# Altium schematic sheet MCU.SchDoc
size A3; SheetNumber: 2; SheetTotal: 3
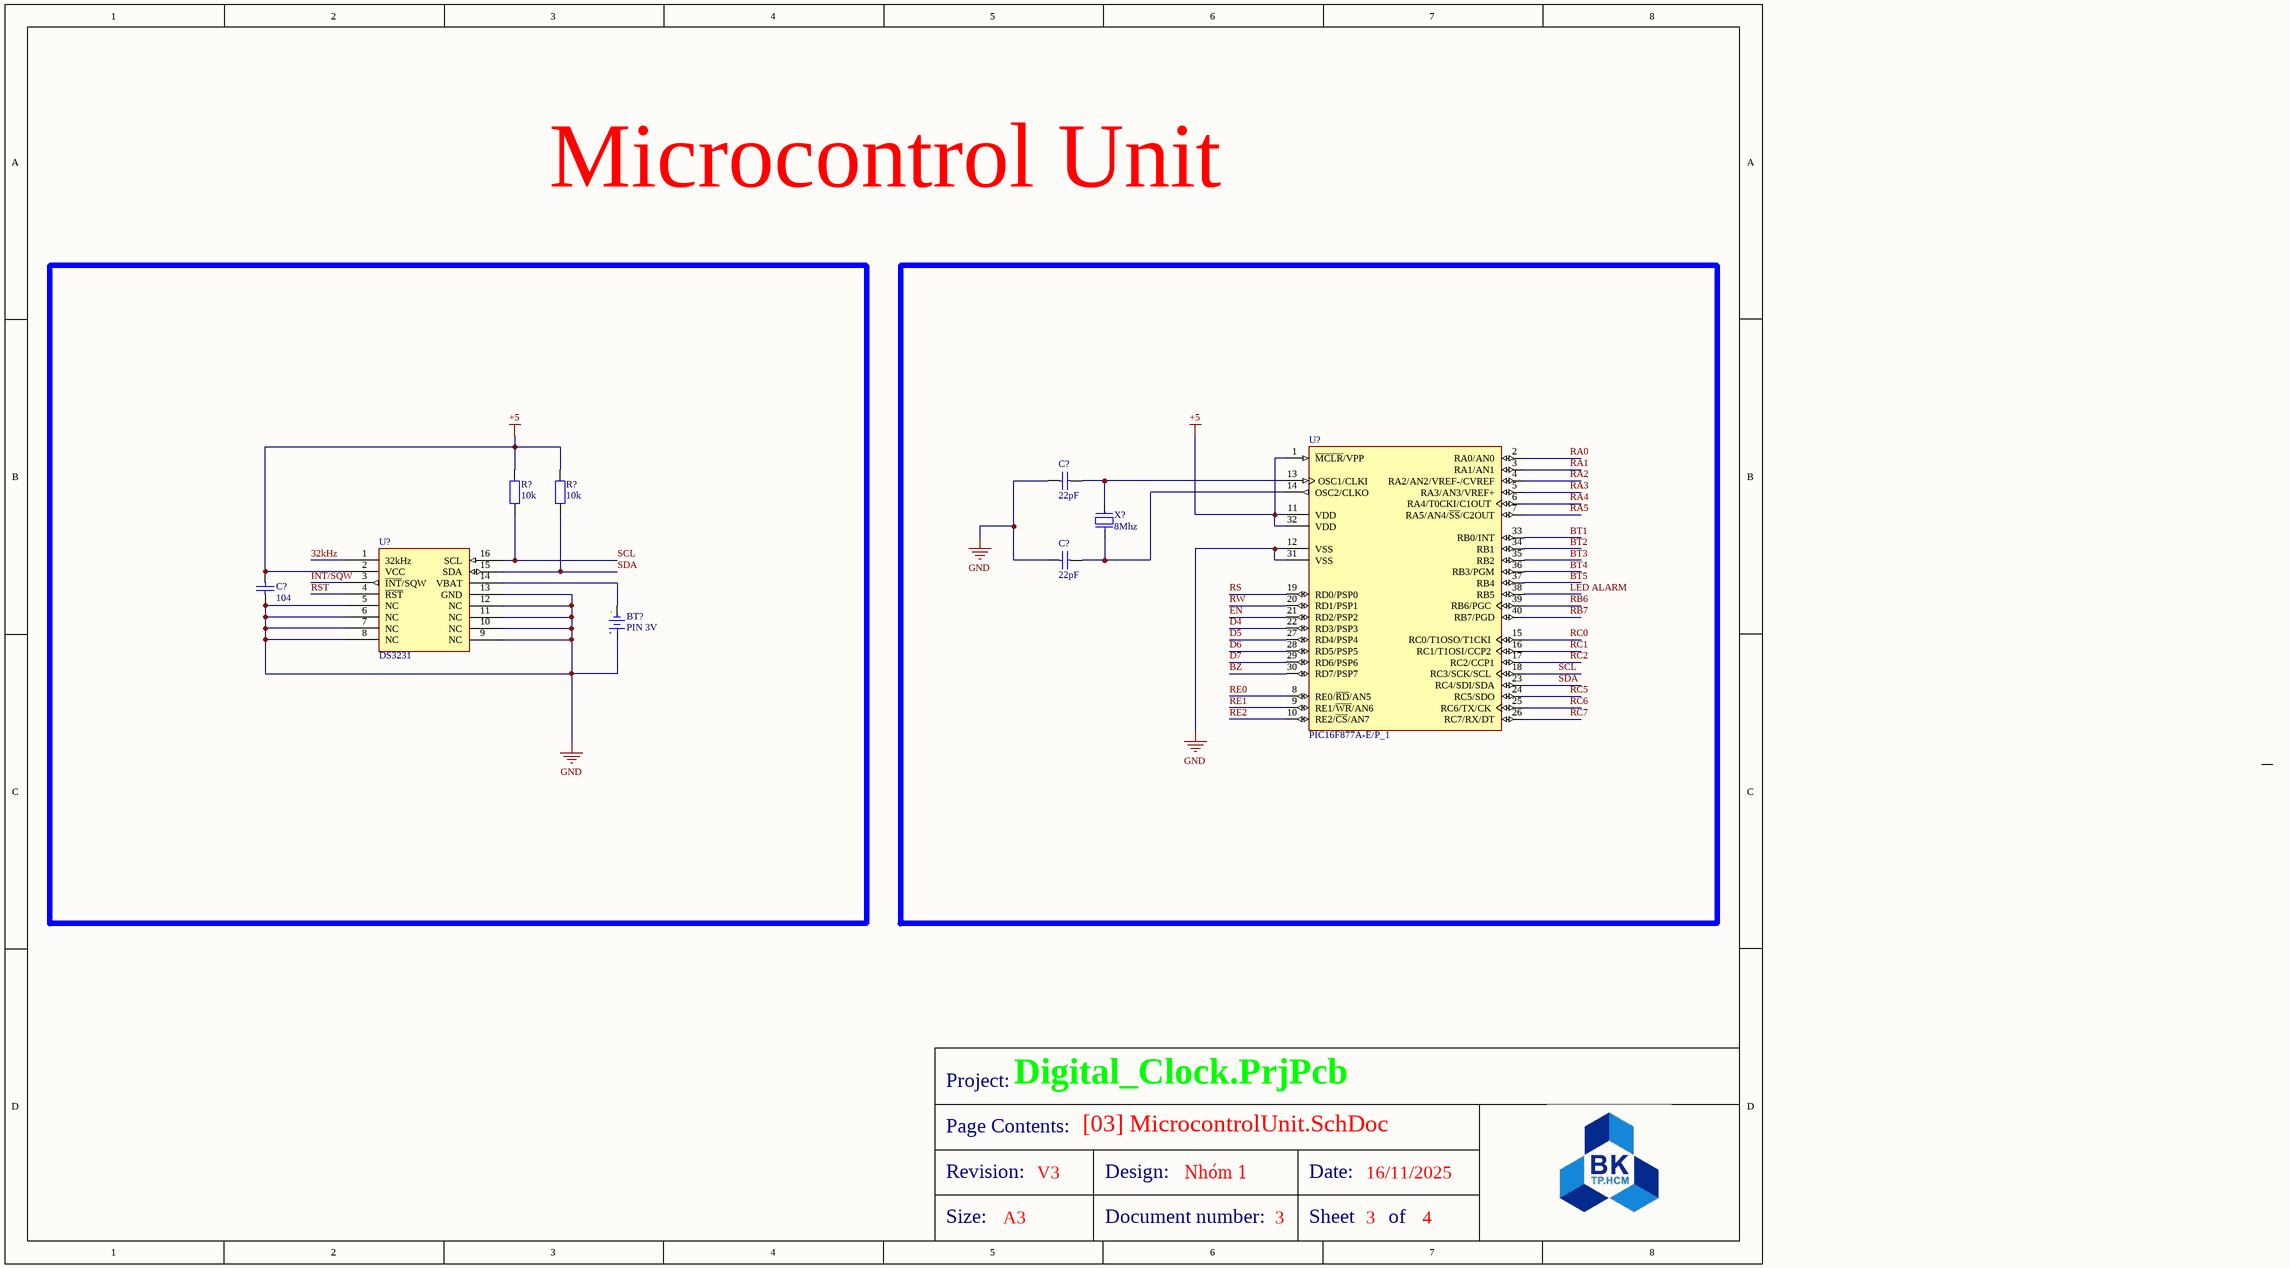
[diagram p0: MCU.SchDoc]

## Parts
(Parts that share a designator on the sheet are numbered #1, #2 ... from top to bottom, then left to right.)
BT?  PIN 3V  [PIN3V]
C?#1  22pF  [tu gom]
C?#2  22pF  [tu gom]
C?#3  104  [tu gom]
R?#1  10k  [tro smd 0603]
R?#2  10k  [tro smd 0603]
U?#1  PIC16F877A-E/P_1  [PDIP600-P40]
U?#2  DS3231  [SL3016]
X?  8Mhz  [XT2]

## Nets
+5: C?#3.1 R?#1.2 R?#2.2 U?#1.1(~{MCLR}/VPP) U?#1.11(VDD) U?#1.32(VDD) U?#2.2(VCC)
GND: BT?.1(+3V) C?#1.2 C?#2.2 C?#3.2 U?#1.12(VSS) U?#1.31(VSS) U?#2.5(NC) U?#2.6(NC) U?#2.7(NC) U?#2.8(NC) U?#2.9(NC) U?#2.10(NC) U?#2.11(NC) U?#2.12(NC) U?#2.13(GND)
32kHz: U?#2.1(32kHz)
BT1: U?#1.33(RB0/INT)
BT2: U?#1.34(RB1)
BT3: U?#1.35(RB2)
BT4: U?#1.36(RB3/PGM)
BT5: U?#1.37(RB4)
BZ: U?#1.30(RD7/PSP7)
D4: U?#1.22(RD3/PSP3)
D5: U?#1.27(RD4/PSP4)
D6: U?#1.28(RD5/PSP5)
D7: U?#1.29(RD6/PSP6)
EN: U?#1.21(RD2/PSP2)
INT/SQW: U?#2.3(~{INT}/SQW)
LED ALARM: U?#1.38(RB5)
RA0: U?#1.2(RA0/AN0)
RA1: U?#1.3(RA1/AN1)
RA2: U?#1.4(RA2/AN2/VREF-/CVREF)
RA3: U?#1.5(RA3/AN3/VREF+)
RA4: U?#1.6(RA4/T0CKI/C1OUT)
RA5: U?#1.7(RA5/AN4/~{SS}/C2OUT)
RB6: U?#1.39(RB6/PGC)
RB7: U?#1.40(RB7/PGD)
RC0: U?#1.15(RC0/T1OSO/T1CKI)
RC1: U?#1.16(RC1/T1OSI/CCP2)
RC2: U?#1.17(RC2/CCP1)
RC5: U?#1.24(RC5/SDO)
RC6: U?#1.25(RC6/TX/CK)
RC7: U?#1.26(RC7/RX/DT)
RE0: U?#1.8(RE0/~{RD}/AN5)
RE1: U?#1.9(RE1/~{WR}/AN6)
RE2: U?#1.10(RE2/~{CS}/AN7)
RS: U?#1.19(RD0/PSP0)
RST: U?#2.4(~{RST})
RW: U?#1.20(RD1/PSP1)
SCL: R?#1.1 U?#1.18(RC3/SCK/SCL) U?#2.16(SCL)
SDA: R?#2.1 U?#1.23(RC4/SDI/SDA) U?#2.15(SDA)
NetBT?_2: BT?.2(GND) U?#2.14(VBAT)
NetC?#1_1: C?#1.1 U?#1.13(OSC1/CLKI) X?.1
NetC?#2_1: C?#2.1 U?#1.14(OSC2/CLKO) X?.2

## Notes on the sheet
- Microcontrol Unit
- Project:
- Digital_Clock.PrjPcb
- Page Contents:
- [03] MicrocontrolUnit.SchDoc
- Revision:
- Size:
- A3
- V3
- Design:
- Document number:
- Nhóm 1
- 3
- Date:
- Sheet
- 16/11/2025
- of
- 4
- (in symbol PIN 3V) -; +

## Library data of the parts
BT? = PIN 3V: Battery 3VDC; Value: PIN 3V
C?#1 C?#2 = Tu gom 22pF 50V: Cắm; Don_Vi: Con; So_Chan: 2; Ten_Linh_Kien: Tụ gốm 22P 50V; Ma_Hang: MH004771; Chung_Loai: Cắm; Kieu_Chan: *
C?#3 = Tu gom 104 50V: Cắm; So_Chan: 2; Ten_Linh_Kien: Tụ gốm 104 100nF 50V; Don_Vi: Con; Ma_Hang: MH004761; Chung_Loai: Cắm; Kieu_Chan: *
R?#1 R?#2 = Tro 0603 5% 10k: Dán; Don_Vi: Con; So_Chan: 2; Ten_Linh_Kien: Trở 0603 5% 10k; Ma_Hang: MH006316; Chung_Loai: Dán; Kieu_Chan: *
U?#1 = PIC16F877A-E/P_1: Enhanced FLASH Microcontroller, 8K (x14-Bit words) FLASH, 368 Bytes RAM, 40-Pin PDIP, Standard VDD Range, Extended Temperature; ComponentAvailability: Unknown. Contact manufacturer to determine status.; Published: 11-Oct-2004; LatestRevisionDate: 29-Jan-2009; LatestRevisionNote: Sch. layout revised. 3D Model Removed.; DatasheetVersion: revB, Oct-2003; PackageVersion: revBB, Aug-2009; PackageReference: PDIP600-P40; Publisher: Altium Limited; PackageDescription: 40-Lead Plastic Dual In-Line (P) - 600 mil Body [PDIP]; Supplier 1: Digi-Key; Supplier Part Number 1: PIC16F877A-E/P-ND; Supplier 2: Farnell; Supplier Part Number 2: 1567990; ComponentLink1Description: Datasheet; ComponentLink1URL: http://ww1.microchip.com/downloads/en/DeviceDoc/39582b.pdf; ComponentLink2Description: Packaging Specification; ComponentLink2URL: http://www.microchip.com/stellent/groups/techpub_sg/documents/packagingspec/en012702.pdf; ComponentLink3Description: Microchip.com Home; ComponentLink3URL: http://www.microchip.com/
X? = XT2: Crystal For all Crystal 2pin.; Value: 8Mhz